# EAGLE design algyan-7th (EAGLE 9.6.2)
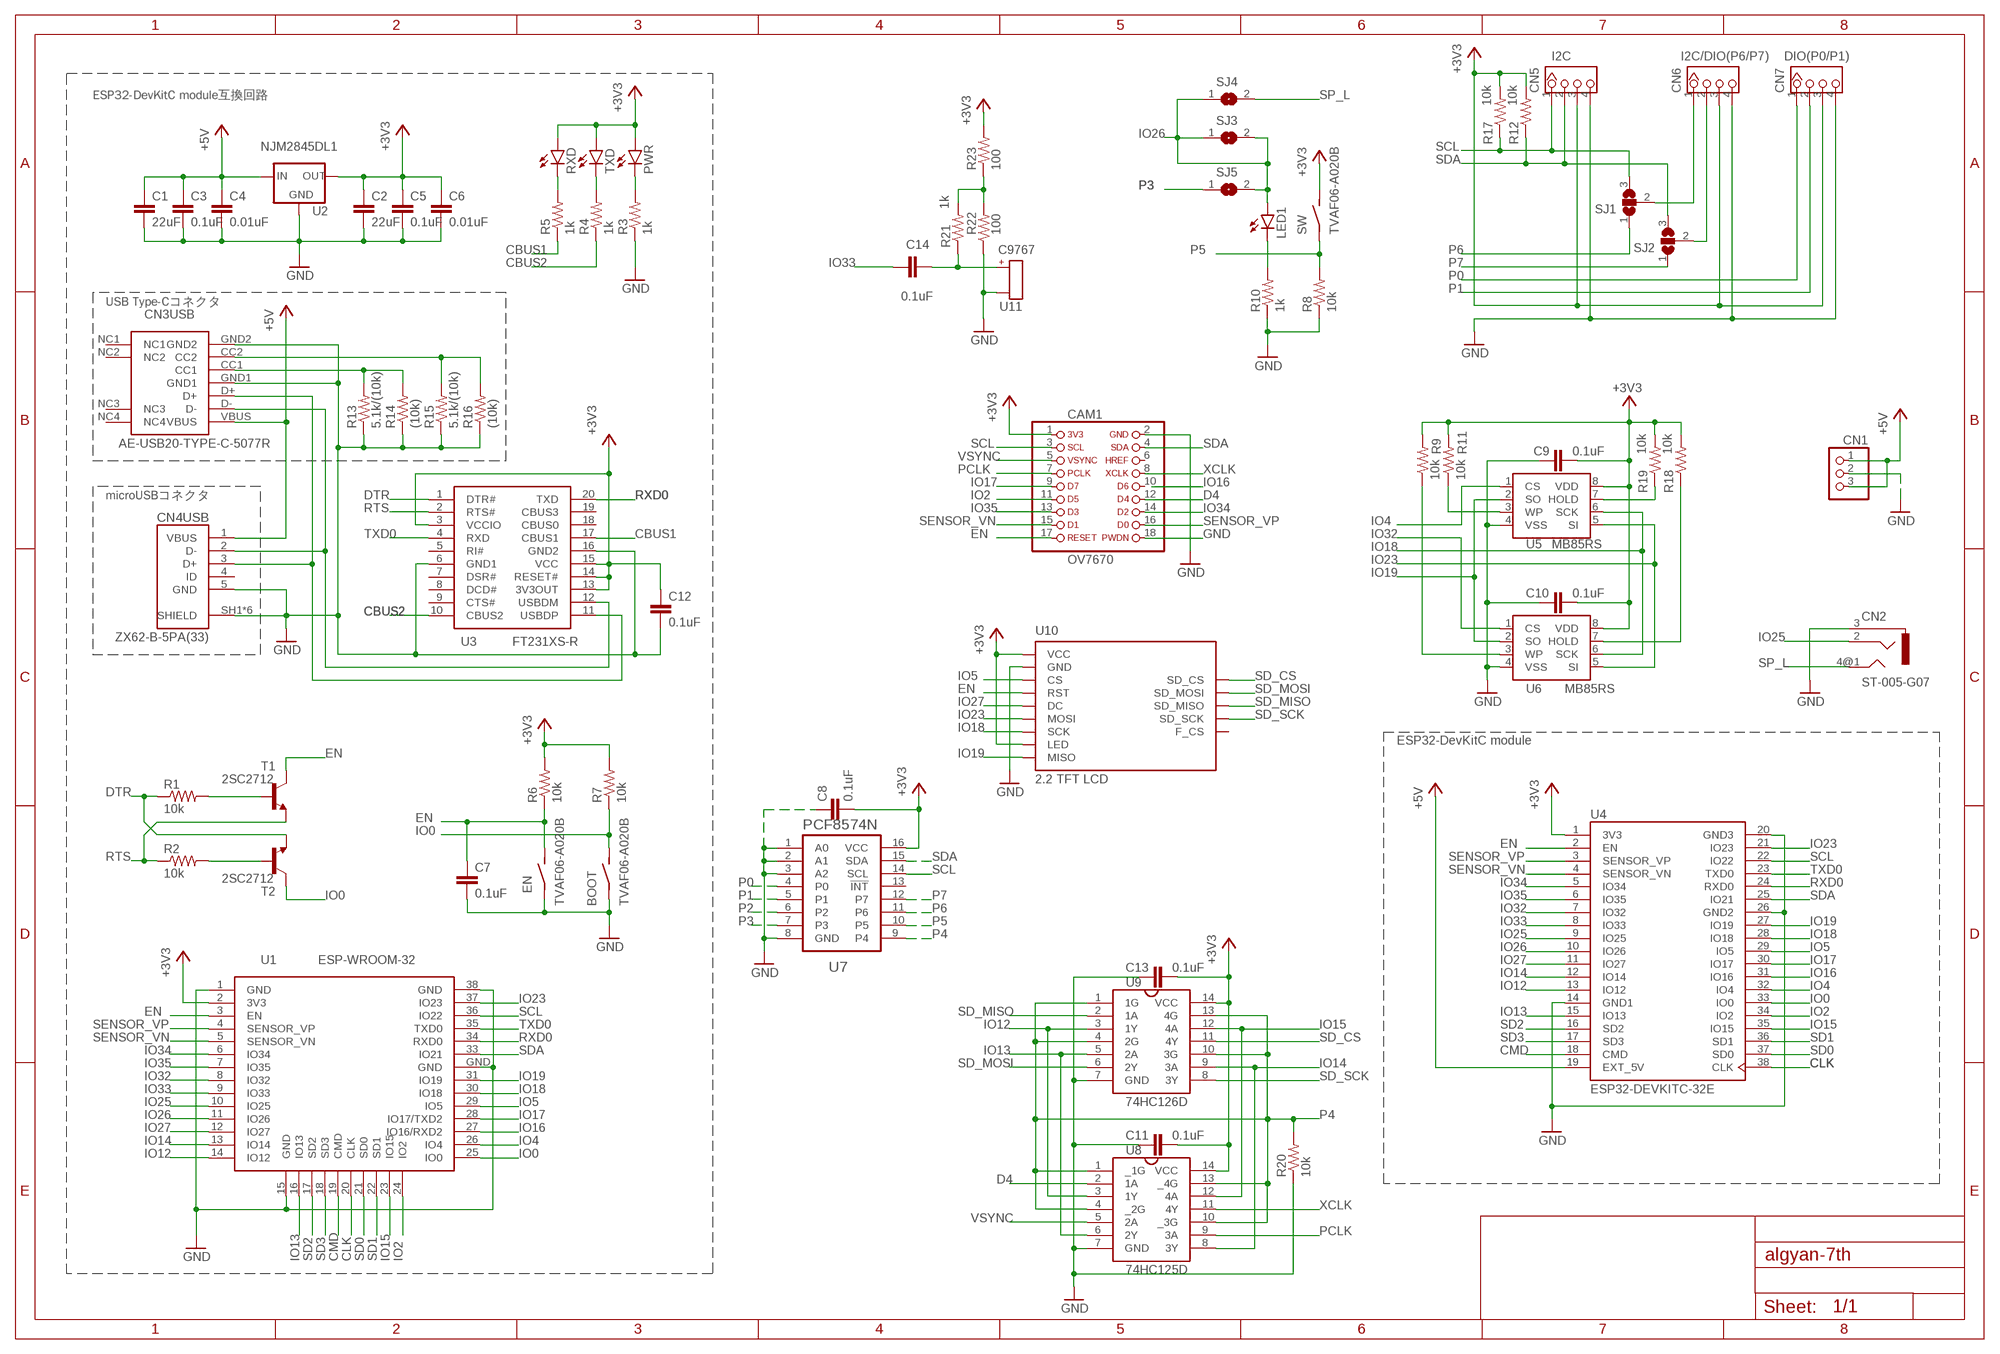
[diagram p0: schematic, sheet 1]

## Parts
BOOT  TVAF06-A020B  [TVAF06-A020B]
C1  22uF  C-EUC3216  [C3216]
C2  22uF  C-EUC3216  [C3216]
C3  0.1uF  C-EUC2012  [C2012]
C4  0.01uF  C-EUC1608  [C1608]
C5  0.1uF  C-EUC2012  [C2012]
C6  0.01uF  C-EUC1608  [C1608]
C7  0.1uF  C-EUC2012  [C2012]
C8  0.1uF  C-EUC2012  [C2012]
C9  0.1uF  C-EUC2012  [C2012]
C10  0.1uF  C-EUC2012  [C2012]
C11  0.1uF  C-EUC2012  [C2012]
C12  0.1uF  C-EUC2012  [C2012]
C13  0.1uF  C-EUC2012  [C2012]
C14  0.1uF  C-EUC2012  [C2012]
CAM1  OV7670  [OV7670]
CN1  PINHD-1X3/90  [1X03/90]
CN2  ST-005-G07  [ST-005-G]
CN3USB  AE-USB20-TYPE-C-5077R  [AE-USB20-TYPE-C-5077R]
CN4USB  ZX62-B-5PA(33)  [HRS_ZX62-B-5PA(33)]
CN5  4P-2.0-90D  GROVE-CONNECTOR-DIP-90D(4P-2.0)  [HW4-2.0-90D]
CN6  4P-2.0-90D  GROVE-CONNECTOR-DIP-90D(4P-2.0)  [HW4-2.0-90D]
CN7  4P-2.0-90D  GROVE-CONNECTOR-DIP-90D(4P-2.0)  [HW4-2.0-90D]
EN  TVAF06-A020B  [TVAF06-A020B]
LED1  LEDCHIPLED_0805  [CHIPLED_0805]
PWR  LEDCHIPLED_0805  [CHIPLED_0805]
R1  10k  R-US_R2012  [R2012]
R2  10k  R-US_R2012  [R2012]
R3  1k  R-US_R2012  [R2012]
R4  1k  R-US_R2012  [R2012]
R5  1k  R-US_R2012  [R2012]
R6  10k  R-US_R2012  [R2012]
R7  10k  R-US_R2012  [R2012]
R8  10k  R-US_R2012  [R2012]
R9  10k  R-US_R2012  [R2012]
R10  1k  R-US_R2012  [R2012]
R11  10k  R-US_R2012  [R2012]
R12  10k  R-US_R2012  [R2012]
R13  5.1k/(10k)  R-US_R2012  [R2012]
R14  (10k)  R-US_R2012  [R2012]
R15  5.1k/(10k)  R-US_R2012  [R2012]
R16  (10k)  R-US_R2012  [R2012]
R17  10k  R-US_R2012  [R2012]
R18  10k  R-US_R2012  [R2012]
R19  10k  R-US_R2012  [R2012]
R20  10k  R-US_R2012  [R2012]
R21  1k  R-US_R2012  [R2012]
R22  100  R-US_R2012  [R2012]
R23  100  R-US_R2012  [R2012]
RXD  LEDCHIPLED_0805  [CHIPLED_0805]
SJ1  SJ2W  [SJ_2]
SJ2  SJ2W  [SJ_2]
SJ3  SJ  [SJ]
SJ4  SJ  [SJ]
SJ5  SJ  [SJ]
SW  TVAF06-A020B  [TVAF06-A020B]
T1  2SC2712  2SC2712YBC808SOT23-BEC  [SOT23-BEC]
T2  2SC2712  2SC2712YBC808SOT23-BEC  [SOT23-BEC]
TXD  LEDCHIPLED_0805  [CHIPLED_0805]
U1  ESP-WROOM-32  [ESP-WROOM-32]
U2  NJM2845DL1  [D-PAK_TO252AA]
U3  FT231XS-R  [SOP64P599X175-20N]
U4  ESP32-DEVKITC-32E  ESP32-DEVKITC-32D  [MODULE_ESP32-DEVKITC-32D]
U5  MB85RS  [DIP8_SOP8]
U6  MB85RS  [DIP8_SOP8]
U7  PCF8574N  [DIP794W45P254L1969H508Q16]
U8  74HC125D  [SO14]
U9  74HC126D  [SO14]
U10  2.2_TFT_LCD  [2.2_TFT_LCD]
U11  C9767  [C9767]

## Nets
+3V3 [VDD]: C2.1 C5.1 C6.1 C8.2 C9.2 C10.2 C11.2 C12.1 C13.2 CAM1.1 CN5.3 CN6.3 CN7.3 PWR.A R6.2 R7.2 R9.2 R11.2 R12.2 R17.2 R18.2 R19.2 R23.2 RXD.A SW.2(S) TXD.A U1.2(3V3) U2.3(OUT) U3.3(VCCIO) U3.13(3V3OUT) U3.14(RESET#) U3.15(VCC) U4.1(3V3) U5.8(VDD) U6.8(VDD) U7.16(VCC) U8.14(VCC) U9.14(VCC) U10.LED U10.VCC
+5V [VDD]: C1.1 C3.1 C4.1 CN1.1 CN1.3 CN3USB.VBUS CN4USB.1(VBUS) U2.1(IN) U4.19(EXT_5V)
CBUS1: R5.1 U3.17(CBUS1)
CBUS2: R4.1 U3.10(CBUS2)
CLK: U1.20(CLK) U4.38(CLK)
CMD: U1.19(CMD) U4.18(CMD)
D4: CAM1.12 U8.2(1A)
DTR: R1.1 T2.E U3.1(DTR#)
EN: C7.1 CAM1.17 EN.2(S) R6.1 T1.C U1.3(EN) U4.2(EN) U10.RST
GND [GND]: BOOT.1(P) C1.2 C2.2 C3.2 C4.2 C5.2 C6.2 C7.2 C8.1 C9.1 C10.1 C11.1 C12.2 C13.1 CAM1.2 CAM1.18 CN1.2 CN2.3 CN3USB.GND1 CN3USB.GND2 CN4USB.5(GND) CN4USB.SH1(SHIELD) CN4USB.SH2(SHIELD) CN4USB.SH3(SHIELD) CN4USB.SH4(SHIELD) CN4USB.SH5(SHIELD) CN4USB.SH6(SHIELD) CN5.4 CN6.4 CN7.4 EN.1(P) R3.1 R8.1 R10.1 R13.1 R14.1 R15.1 R16.1 R20.1 R22.1 U1.1(GND) U1.15(GND) U1.38(GND) U1.GND U2.4(GND) U3.6(GND1) U3.16(GND2) U4.14(GND1) U4.20(GND3) U4.26(GND2) U5.4(VSS) U6.4(VSS) U7.1(A0) U7.2(A1) U7.3(A2) U7.8(GND) U8.7(GND) U9.7(GND) U10.GND U11.-
IO0: BOOT.2(S) R7.1 T2.C U1.25(IO0) U4.33(IO0)
IO2: CAM1.11 U1.24(IO2) U4.34(IO2)
IO4: U1.26(IO4) U4.32(IO4) U5.1(CS)
IO5: U1.29(IO5) U4.29(IO5) U10.CS
IO12: U1.14(IO12) U4.13(IO12) U8.3(1Y) U9.3(1Y)
IO13: U1.16(IO13) U4.15(IO13) U8.6(2Y) U9.5(2A)
IO14: U1.13(IO14) U4.12(IO14) U8.8(3Y) U9.9(3A)
IO15: U1.23(IO15) U4.35(IO15) U8.12(4A) U9.12(4A)
IO16: U1.27(IO16/RXD2) U4.31(IO16)
IO17: CAM1.9 U1.28(IO17/TXD2) U4.30(IO17)
IO18: U1.30(IO18) U4.28(IO18) U5.6(SCK) U6.6(SCK) U10.SCK
IO19: U1.31(IO19) U4.27(IO19) U5.2(SO) U6.2(SO) U10.MISO
IO23: U1.37(IO23) U4.21(IO23) U5.5(SI) U6.5(SI) U10.MOSI
IO25: CN2.2 U1.10(IO25) U4.9(IO25)
IO26: LED1.A SJ3.1 SJ3.2 SJ4.1 SJ5.2 U1.11(IO26) U4.10(IO26)
IO27: U1.12(IO27) U4.11(IO27) U10.DC
IO32: U1.8(IO32) U4.7(IO32) U6.1(CS)
IO33: C14.1 U1.9(IO33) U4.8(IO33)
IO34: CAM1.14 U1.6(IO34) U4.5(IO34)
IO35: CAM1.13 U1.7(IO35) U4.6(IO35)
N$1: R1.2 T1.B
N$2: R2.2 T2.B
N$3: LED1.C R10.2
N$4: C14.2 R21.1 U11.+
N$5: R9.1 U6.3(WP)
N$6: R11.1 U5.3(WP)
N$7: R21.2 R22.2 R23.1
N$8: R19.1 U5.7(HOLD)
N$9: R18.1 U6.7(HOLD)
N$10: CN6.2 SJ2.2
N$11: CN6.1 SJ1.2
N$13: CN3USB.CC1 R13.2 R14.2
N$14: CN3USB.CC2 R15.2 R16.2
N$74: CN3USB.D- CN4USB.2(D-) U3.12(USBDM)
N$81: CN3USB.D+ CN4USB.3(D+) U3.11(USBDP)
N$82: PWR.C R3.2
N$84: R5.2 RXD.C
P0: CN7.1 U7.4(P0)
P1: CN7.2 U7.5(P1)
P2: U7.6(P2)
P3: SJ5.1 U7.7(P3)
P4: R20.2 U7.9(P4) U8.1(_1G) U8.4(_2G) U8.10(_3G) U8.13(_4G) U9.1(1G) U9.4(2G) U9.10(3G) U9.13(4G)
P5: R8.2 SW.1(P) U7.10(P5)
P6: SJ1.1 U7.11(P6)
P7: SJ2.1 U7.12(P7)
PCLK: CAM1.7 U8.9(3A)
RTS: R2.1 T1.E U3.2(RTS#)
RXD0: U1.34(RXD0) U3.20(TXD) U4.24(RXD0)
SCL: CAM1.3 CN5.1 R17.1 SJ1.3 U1.36(IO22) U4.22(IO22) U7.14(SCL)
SD0: U1.21(SD0) U4.37(SD0)
SD1: U1.22(SD1) U4.36(SD1)
SD2: U1.17(SD2) U4.16(SD2)
SD3: U1.18(SD3) U4.17(SD3)
SD_CS: U9.11(4Y) U10.SD_CS
SD_MISO: U9.2(1A) U10.SD_MISO
SD_MOSI: U9.6(2Y) U10.SD_MOSI
SD_SCK: U9.8(3Y) U10.SD_SCK
SDA: CAM1.4 CN5.2 R12.1 SJ2.3 U1.33(IO21) U4.25(IO21) U7.15(SDA)
SENSOR_VN: CAM1.15 U1.5(SENSOR_VN) U4.4(SENSOR_VN)
SENSOR_VP: CAM1.16 U1.4(SENSOR_VP) U4.3(SENSOR_VP)
SP_L: CN2.4@1 SJ4.2
TTXD: R4.2 TXD.C
TXD0: U1.35(TXD0) U3.4(RXD) U4.23(TXD0)
VSYNC: CAM1.5 U8.5(2A)
XCLK: CAM1.8 U8.11(4Y)
Unconnected: CAM1.6 CAM1.10 CN2.4@2 CN3USB.NC1 CN3USB.NC2 CN3USB.NC3 CN3USB.NC4 CN4USB.4(ID) U3.5(RI#) U3.7(DSR#) U3.8(DCD#) U3.9(CTS#) U3.18(CBUS0) U3.19(CBUS3) U7.13(!INT) U10.F_CS

## Notes on the sheet
- ESP32-DevKitC module互換回路
- USB Type-Cコネクタ
- microUSBコネクタ
- ESP32-DevKitC module

## Library data of the parts
BOOT EN SW = swest-parts:TVAF06-A020B
C1-C14 = rcl:C-EU: CAPACITOR, European symbol; SPICEPREFIX: C
CAM1 = swest-parts:OV7670: PIN HEADER
CN1 = pinhead2:PINHD-1X3: PIN HEADER
CN2 = swest-parts:ST-005-G: Jack connectors according to JISC 6560, 3.5 mm Klinkensteckverbinder nach JISC 6560, 3,5 mm Source: http://www.lumberg.com/Produkte/PDFs/1503_08.pdf; OC_FARNELL: unknown; OC_NEWARK: unknown
CN3USB = swest-parts:AE-USB20-TYPE-C-5077R
CN4USB = swest-parts:ZX62-B-5PA(33): ZX Series 5 Position Right Angle PCB Wire Micro B USB Plug Buy Part <https://snapeda.com/parts/ZX62-B-5PA%2833%29/Hirose/view-part/?ref=eda>; ARROW_ELECTRONICS-PURCHASE-URL: https://snapeda.com/shop?store=Arrow+Electronics&id=524781; AVAILABILITY: Good; DESCRIPTION: USB - micro B USB 2.0 Receptacle Connector 5 Position Surface Mount, Right Angle; DIGIKEY-PURCHASE-URL: https://snapeda.com/shop?store=DigiKey&id=524781; MF: Hirose; MOUSER-PURCHASE-URL: https://snapeda.com/shop?store=Mouser&id=524781; MP: ZX62-B-5PA(33); PACKAGE: None; PRICE: None
CN5 = swest-parts:GROVE-CONNECTOR-DIP-90D(4P-2.0): 320110034; CN5: I2C
CN6 = swest-parts:GROVE-CONNECTOR-DIP-90D(4P-2.0): 320110034; CN6: I2C/DIO(P6/P7)
CN7 = swest-parts:GROVE-CONNECTOR-DIP-90D(4P-2.0): 320110034; CN7: DIO(P0/P1)
LED1 PWR RXD TXD = swest-parts:LED: LED OSRAM: - CHIPLED LG R971, LG N971, LY N971, LG Q971, LY Q971, LO R971, LY R971 LH N974, LH R974 LS Q976, LO Q976, LY Q976 LO Q996 - Hyper CHIPLED LW Q18S LB Q993, LB Q99A, LB R99A - SideLED LS A670, LO A670, LY A670, LG A670, LP A670 LB A673, LV A673, LT A673, LW A673 LH A674 LY A675 LS A676, LA A676, LO A676, LY A676, LW A676 LS A679, LY A679, LG A679 - Hyper Micro SIDELED® LS Y876, LA Y876, LO Y876, LY Y876 LT Y87S - SmartLED LW L88C, LW L88S LB L89C, LB L89S, LG L890 LS L89K, LO L89K, LY L89K LS L896, LA L896, LO L896, LY L896 - TOPLED LS T670, LO T670, LY T670, LG T670, LP T670 LSG T670, LSP T670, LSY T670, LOP T670, LYG T670 LG T671, LOG T671, LSG T671 LB T673, LV T673, LT T673, LW T673 LH T674 LS T676, LA T676, LO T676, LY T676, LB T676, LH T676, LSB T676, LW T676 LB T67C, LV T67C, LT T67C, LS T67K, LO T67K, LY T67K, LW E67C LS E67B, LA E67B, LO E67B, LY E67B, LB E67C, LV E67C, LT E67C LW T67C LS T679, LY T679, LG T679 LS T770, LO T770, LY T770, LG T770, LP T770 LB T773, LV T773, LT T773, LW T773 LH T774 LS E675, LA E675, LY E675, LS T675 LS T776, LA T776, LO T776, LY T776, LB T776 LHGB T686 LT T68C, LB T68C - Hyper Mini TOPLED® LB M676 - Mini TOPLED Santana® LG M470 LS M47K, LO M47K, LY M47K Source: http://www.osram.convergy.de LUXEON: - LUMILED® LXK2-PW12-R00, LXK2-PW12-S00, LXK2-PW14-U00, LXK2-PW14-V00 LXK2-PM12-R00, LXK2-PM12-S00, LXK2-PM14-U00 LXK2-PE12-Q00, LXK2-PE12-R00, LXK2-PE12-S00, LXK2-PE14-T00, LXK2-PE14-U00 LXK2-PB12-K00, LXK2-PB12-L00, LXK2-PB12-M00, LXK2-PB14-N00, LXK2-PB14-P00, LXK2-PB14-Q00 LXK2-PR12-L00, LXK2-PR12-M00, LXK2-PR14-Q00, LXK2-PR14-R00 LXK2-PD12-Q00, LXK2-PD12-R00, LXK2-PD12-S00 LXK2-PH12-R00, LXK2-PH12-S00 LXK2-PL12-P00, LXK2-PL12-Q00, LXK2-PL12-R00 Source: www.luxeon.com KINGBRIGHT: KA-3528ASYC Source: www.kingbright.com
R1-R23 = rcl:R-US_: RESISTOR, American symbol; SPICEPREFIX: R
SJ1 SJ2 = swest-parts:SJ2W: SMD solder JUMPER
SJ3-SJ5 = swest-parts:SJ: SMD solder JUMPER
T1 T2 = transistor:2SC2712Y: NPN Transistror BF959 corrected 2008.03.06
U1 = swest-parts:ESP-WROOM-32: Espressif Systems ESP-WROOM-32
U2 = swest-parts:NJM2845DL1
U3 = swest-parts:FT231XS-R: FTDI Chip FT231XS-R, Interface RS232, RS422, RS485, SIE, UART 3MBd, 5 V, 20-pin, SSOP Source: Datasheet <http://uk.rs-online.com/web/p/products/7570032P>; DESCRIPTION: FTDI Chip FT231XS-R, Interface RS232, RS422, RS485, SIE, UART 3MBd, 5 V, 20-pin, SSOP; HEIGHT: 1.7526mm; MANUFACTURER_NAME: FTDI Chip; MANUFACTURER_PART_NUMBER: FT231XS-R; RS_PART_NUMBER: 7570032P
U4 = swest-parts:ESP32-DEVKITC-32D: Eval Board For Esp-Wroom-32 Buy Part <https://snapeda.com/parts/ESP32-DEVKITC-32D/Espressif%20Systems/view-part/?ref=eda>; AVAILABILITY: Warning; DESCRIPTION: - Transceiver; 802.11 b/g/n (Wi-Fi, WiFi, WLAN), Bluetooth® Smart Ready 4.x Dual Mode For Use With ESP-WROOM-32; DIGIKEY-PURCHASE-URL: https://snapeda.com/shop?store=DigiKey&id=2777395; MF: Espressif Systems; MOUSER-PURCHASE-URL: https://snapeda.com/shop?store=Mouser&id=2777395; MP: ESP32-DEVKITC-32D; PACKAGE: None; PRICE: None
U5 U6 = swest-parts:MB85RS
U7 = swest-parts:PCF8574N: Check availability <https://pricing.snapeda.com/parts/PCF8574N/Texas%20Instruments/view-part?ref=eda>; AVAILABILITY: In Stock; DESCRIPTION: Remote 8-Bit I/O Expander for I2C-Bus 16-PDIP -40 to 85; MF: Texas Instruments; MP: PCF8574N; PACKAGE: PDIP-16 Texas Instruments; PRICE: None; PURCHASE-URL: https://pricing.snapeda.com/search/part/PCF8574N/?ref=eda
U8 = swest-parts:74*125: Quad bus BUFFER, 3-state
U9 = swest-parts:74*126: Quad bus BUFFER, 3-state
U10 = swest-parts:2.2_TFT_LCD
U11 = swest-parts:C9767: C9767 <http://akizukidenshi.com/catalog/g/gP-01810/> Electret Condenser Microphone; C9767: C9767

## Net classes
1 GND: width 0.305 mm
2 VDD: width 0.305 mm

## Board
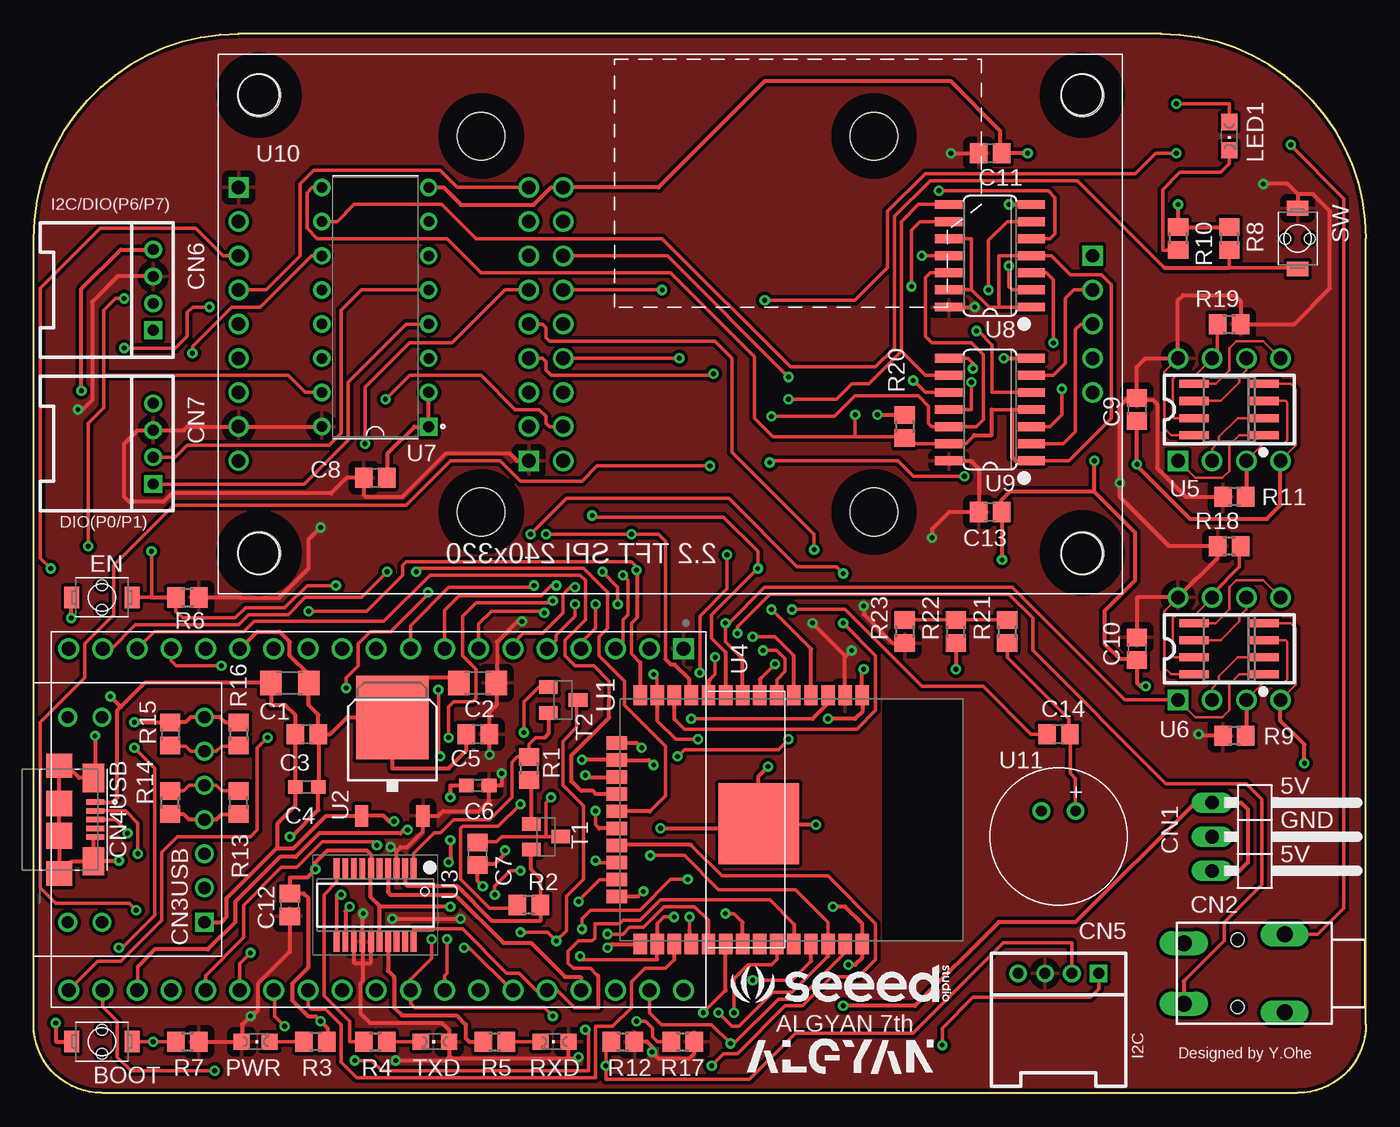
[diagram p1: board, top side]
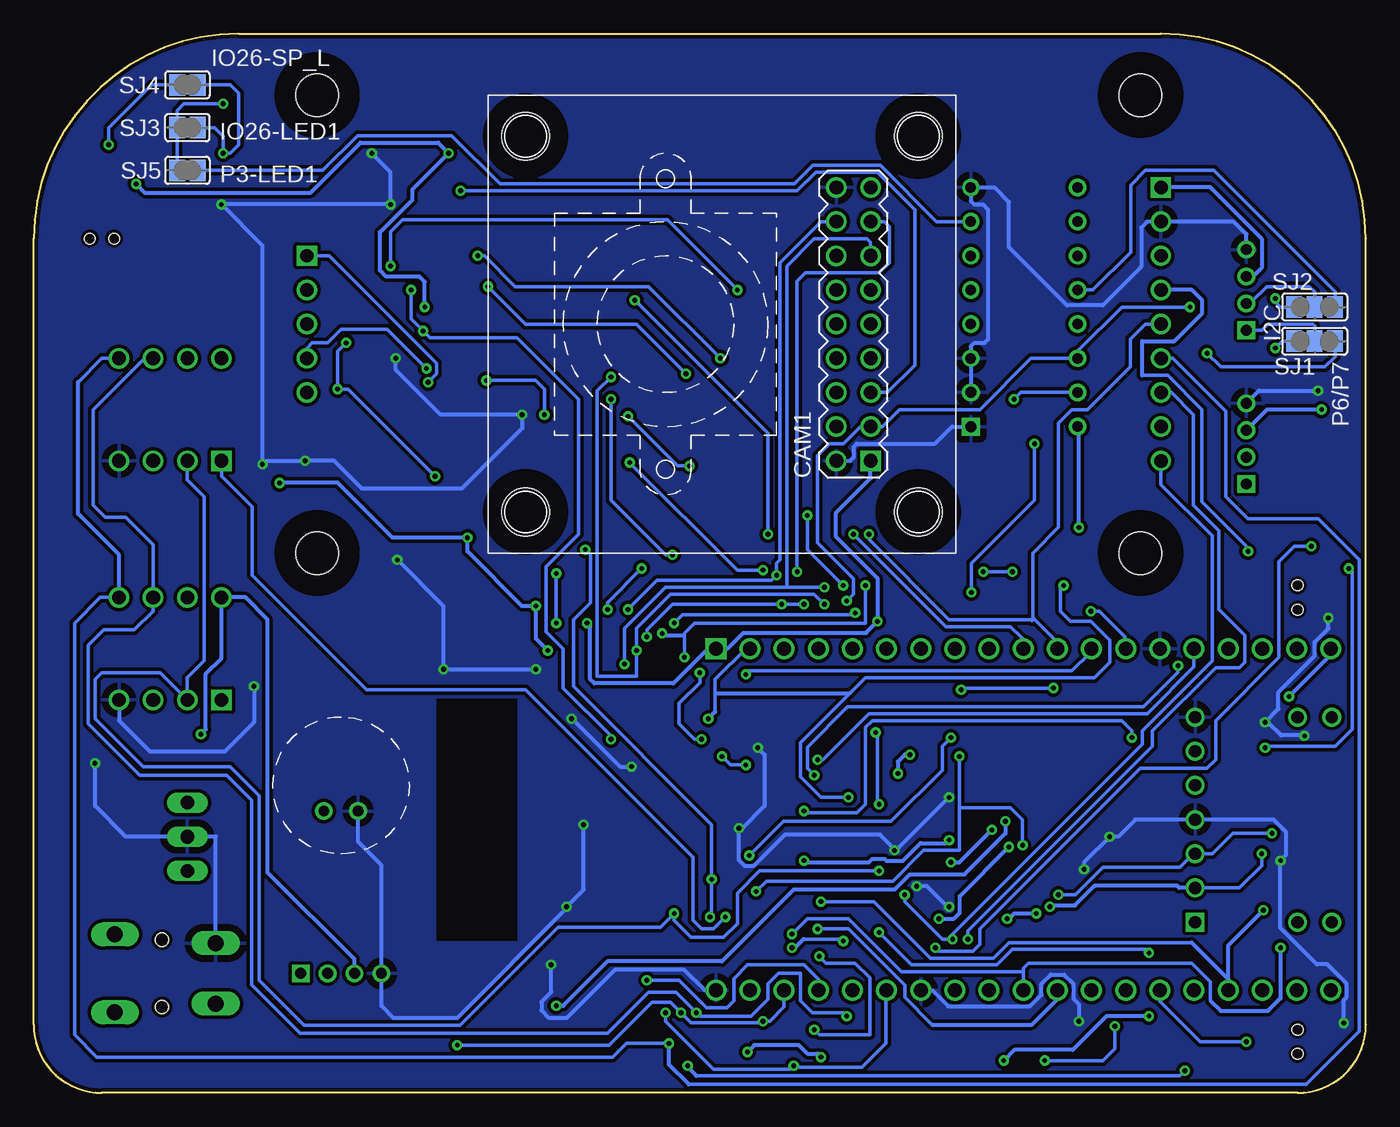
[diagram p2: board, bottom side, seen from below]

Size 99.06 x 78.74 mm. Coordinates in mm from the lower left corner, seen from the top.
Outline: 5.08,0 93.98,0 arc90 99.06,5.08 99.06,63.5 arc90 83.82,78.74 15.24,78.74 arc90 0,63.5 0,5.08 arc90 5.08,0
Copper layers (1*16): Top 0.035mm / dielectric 1.5mm / Bottom 0.035mm
Design rules "default *": minimum track width 10mil, minimum drill 0.35mm, track to track 10mil, track to pad 10mil, pad to pad 6mil, via to via 10mil, smd to smd 6mil, copper to edge 10mil, drill to drill 10mil, minimum pad ring 10mil, minimum via ring 8mil, stop-mask expansion 6mil, vias tented up to drill 0.4mm, thermal gap 20mil

### Footprints (pad centres in the part's own frame; a part is rotated, then mirrored left to right if it is on the bottom)
TVAF06-A020B = smd 1.1 x 1.6: 1 -2.25,0; 2 2.25,0 | hole 0.8: 0,0.9; 0,-0.9
C3216 = smd 1.6 x 1.8: 1 -1.4,0; 2 1.4,0
C2012 = smd 1.3 x 1.5: 1 -0.85,0; 2 0.85,0
C1608 = smd 1.1 x 1: 1 -0.85,0; 2 0.85,0
OV7670 = drill 1.016 square: 1 0,0 | drill 1.016: 2 2.54,0; 3 0,-2.54; 4 2.54,-2.54; 5 0,-5.08; 6 2.54,-5.08; 7 0,-7.62; 8 2.54,-7.62; 9 0,-10.16; 10 2.54,-10.16; 11 0,-12.7; 12 2.54,-12.7; 13 0,-15.24; 14 2.54,-15.24; 15 0,-17.78; 16 2.54,-17.78; 17 0,-20.32; 18 2.54,-20.32 | hole 3.556: -3.556,3.81; 25.654,3.81; 25.654,-24.13; -3.556,-24.13
1X03/90 = drill 1.016 long: 1 -2.54,-3.81; 2 0,-3.81; 3 2.54,-3.81
ST-005-G = drill 1.2 long: 2 2.25,-11; 3 -2.25,-11; 4@1 -2.9,-3.5; 4@2 2.9,-3.5 | hole 1: -2.5,-7; 2.5,-7
AE-USB20-TYPE-C-5077R = drill 0.9: CC1 0,10.16; CC2 0,12.7; D+ 0,5.08; D- 0,2.54; GND1 0,7.62; GND2 0,15.24; NC1 -10.16,15.24; NC2 -7.62,15.24; NC3 -10.16,0; NC4 -7.62,0 | drill 0.9 square: VBUS 0,0
HRS_ZX62-B-5PA(33) = smd 0.4 x 1.35: 1 -1.3,2.675; 2 -0.65,2.675; 3 0,2.675; 4 0.65,2.675; 5 1.3,2.675 | smd 2.1 x 1.6: SH1 -3.1,2.55; SH6 3.1,2.55 | smd 1.8 x 1.9: SH2 -4,0; SH5 4,0 | smd 1.9 x 1.9: SH3 -1.2,0; SH4 1.2,0
HW4-2.0-90D = drill 0.8 pad 1.27 square: 1 -3,0 | drill 0.8 pad 1.27: 2 -1,0; 3 1,0; 4 3,0
CHIPLED_0805 = smd 1.2 x 1.2: A 0,-1.05; C 0,1.05
R2012 = smd 1.3 x 1.5: 1 -0.85,0; 2 0.85,0
SJ_2 = smd 1.168 x 1.6: 1 -1.524,0; 2 0,0; 3 1.524,0
SJ = smd 1.168 x 1.6: 1 -0.762,0; 2 0.762,0
SOT23-BEC = smd 1 x 1.4: B -0.95,-1.1; C 0,1.1; E 0.95,-1.1
ESP-WROOM-32 = smd 1.5 x 1: 1 -9.25,7; 2 -9.25,5.73; 3 -9.25,4.46; 4 -9.25,3.19; 5 -9.25,1.92; 6 -9.25,0.65; 7 -9.25,-0.62; 8 -9.25,-1.89; 9 -9.25,-3.16; 10 -9.25,-4.43; 11 -9.25,-5.7; 12 -9.25,-6.97; 13 -9.25,-8.24; 14 -9.25,-9.51; 25 9.25,-9.51; 26 9.25,-8.24; 27 9.25,-6.97; 28 9.25,-5.7; 29 9.25,-4.43; 30 9.25,-3.16; 31 9.25,-1.89; 32 9.25,-0.62; 33 9.25,0.65; 34 9.25,1.92; 35 9.25,3.19; 36 9.25,4.46; 37 9.25,5.73; 38 9.25,7 | smd 1 x 1.5: 15 -5.7,-11.25; 16 -4.43,-11.25; 17 -3.16,-11.25; 18 -1.89,-11.25; 19 -0.62,-11.25; 20 0.65,-11.25; 21 1.92,-11.25; 22 3.19,-11.25; 23 4.46,-11.25; 24 5.73,-11.25 | smd 6 x 6: GND 0.3,-0.7
D-PAK_TO252AA = smd 1 x 1.6: 1 -2.28,-4.8; 3 2.28,-4.8 | smd 5.4 x 6.2: 4 0,2.5
SOP64P599X175-20N = smd 1.526 x 0.435: 1 -2.712,2.858; 2 -2.712,2.222; 3 -2.712,1.588; 4 -2.712,0.952; 5 -2.712,0.318; 6 -2.712,-0.318; 7 -2.712,-0.952; 8 -2.712,-1.588; 9 -2.712,-2.222; 10 -2.712,-2.858; 11 2.712,-2.858; 12 2.712,-2.222; 13 2.712,-1.588; 14 2.712,-0.952; 15 2.712,-0.318; 16 2.712,0.318; 17 2.712,0.952; 18 2.712,1.588; 19 2.712,2.222; 20 2.712,2.858
MODULE_ESP32-DEVKITC-32D = drill 1.04 square: 1 -12.7,19.76 | drill 1.04: 2 -12.7,17.22; 3 -12.7,14.68; 4 -12.7,12.14; 5 -12.7,9.6; 6 -12.7,7.06; 7 -12.7,4.52; 8 -12.7,1.98; 9 -12.7,-0.56; 10 -12.7,-3.1; 11 -12.7,-5.64; 12 -12.7,-8.18; 13 -12.7,-10.72; 14 -12.7,-13.26; 15 -12.7,-15.8; 16 -12.7,-18.34; 17 -12.7,-20.88; 18 -12.7,-23.42; 19 -12.7,-25.96; 20 12.7,19.76; 21 12.7,17.22; 22 12.7,14.68; 23 12.7,12.14; 24 12.7,9.6; 25 12.7,7.06; 26 12.7,4.52; 27 12.7,1.98; 28 12.7,-0.56; 29 12.7,-3.1; 30 12.7,-5.64; 31 12.7,-8.18; 32 12.7,-10.72; 33 12.7,-13.26; 34 12.7,-15.8; 35 12.7,-18.34; 36 12.7,-20.88; 37 12.7,-23.42; 38 12.7,-25.96
DIP8_SOP8 = drill 1.016 square: 1 -3.81,3.81 | drill 1.016: 2 -3.81,1.27; 3 -3.81,-1.27; 4 -3.81,-3.81; 5 3.81,-3.81; 6 3.81,-1.27; 7 3.81,1.27; 8 3.81,3.81 | smd 0.6 x 2.2: P1 -1.905,-2.6; P2 -0.635,-2.6; P3 0.635,-2.6; P4 1.905,-2.6; P5 1.905,2.6; P6 0.635,2.6; P7 -0.635,2.6; P8 -1.905,2.6
DIP794W45P254L1969H508Q16 = drill 0.813 square: 1 -3.97,8.89 | drill 0.813: 2 -3.97,6.35 | drill 0.78: 3 -3.97,3.81; 4 -3.97,1.27; 5 -3.97,-1.27; 6 -3.97,-3.81; 7 -3.97,-6.35; 8 -3.97,-8.89; 9 3.97,-8.89; 10 3.97,-6.35; 11 3.97,-3.81; 12 3.97,-1.27; 13 3.97,1.27; 14 3.97,3.81; 15 3.97,6.35; 16 3.97,8.89
SO14 = smd 0.66 x 2.032: 1 -3.81,-3.073; 2 -2.54,-3.073; 3 -1.27,-3.073; 4 0,-3.073; 5 1.27,-3.073; 6 2.54,-3.073; 7 3.81,-3.073; 8 3.81,3.073; 9 2.54,3.073; 10 1.27,3.073; 11 0,3.073; 12 -1.27,3.073; 13 -2.54,3.073; 14 -3.81,3.073
2.2_TFT_LCD = drill 1: CS 0,-5.08; DC 0,-10.16; F_CS 63.5,-15.24; GND 0,-2.54; LED 0,-17.78; MISO 0,-20.32; MOSI 0,-12.7; RST 0,-7.62; SCK 0,-15.24; SD_MISO 63.5,-10.16; SD_MOSI 63.5,-7.62; SD_SCK 63.5,-12.7 | drill 1 square: SD_CS 63.5,-5.08; VCC 0,0 | hole 3.175: 1.524,6.858; 1.524,-27.178; 62.738,-27.178; 62.738,6.858
C9767 = drill 0.8: + 1.27,1.905; - -1.27,1.905

### Placement (x,y rotation side)
BOOT  5.08,3.81 0 top
C1  19.05,30.48 0 top
C2  33.02,30.48 180 top
C3  20.32,26.67 0 top
C4  20.32,22.73 0 top
C5  33.02,26.67 180 top
C6  33.02,22.86 180 top
C7  33.02,17.78 270 top
C8  25.4,45.72 180 top
C9  82.04,50.8 90 top
C10  82.04,33.02 90 top
C11  71.12,69.85 180 top
C12  19.05,13.97 90 top
C13  71.12,43.18 180 top
C14  76.2,26.67 0 top
CAM1  36.83,46.99 180 bottom
CN1  91.44,19.05 270 top
CN2  96.52,8.89 270 top
CN3USB  12.7,12.7 0 top
CN4USB  1.91,20.32 270 top
CN5  76.2,8.89 180 top
CN6  8.89,59.69 90 top
CN7  8.89,48.26 90 top
EN  5.08,36.83 0 top
LED1  88.9,71.12 180 top
PWR  16.51,3.81 270 top
R1  36.83,24.13 270 top
R2  36.83,13.97 180 top
R3  20.95,3.81 180 top
R4  25.4,3.81 0 top
R5  34.29,3.81 0 top
R6  11.43,36.83 0 top
R7  11.43,3.81 0 top
R8  88.9,63.5 270 top
R9  89.28,26.54 180 top
R10  85.09,63.5 270 top
R11  89.28,44.32 180 top
R12  43.81,3.81 0 top
R13  15.24,21.59 90 top
R14  10.16,21.59 90 top
R15  10.16,26.67 270 top
R16  15.24,26.67 270 top
R17  48.26,3.81 0 top
R18  88.9,40.64 180 top
R19  88.9,57.15 0 top
R20  64.77,49.53 270 top
R21  72.39,34.29 90 top
R22  68.58,34.29 90 top
R23  64.77,34.29 270 top
RXD  38.73,3.81 90 top
SJ1  3.81,55.88 180 bottom
SJ2  3.81,58.42 180 bottom
SJ3  87.63,71.75 0 bottom
SJ4  87.63,74.93 180 bottom
SJ5  87.63,68.58 180 bottom
SW  93.98,63.5 90 top
T1  38.1,19.05 270 top
T2  39.37,29.21 270 top
TXD  29.84,3.81 90 top
U1  54.61,20.32 270 top
U2  26.67,25.4 0 top
U3  25.4,13.97 270 top
U4  28.57,20.32 270 top
U5  88.9,50.8 90 top
U6  88.9,33.02 90 top
U7  25.4,58.42 180 top
U8  71.12,62.23 90 top
U9  71.12,50.8 90 top
U10  15.24,67.31 0 top
U11  76.2,19.05 0 top

### Tracks (layer width: path | path; a pad name or v marks a point on that pad's centre or on a via)
+3V3  (via drill 0.35)
  Top 0.305: U3.13 23.81,9.72 23.88,9.65 24.51,9.65 | 24.51,9.65 25.02,9.65 25.08,9.71 U3.15 | 24.51,9.65 24.45,9.71 | 24.45,9.71 U3.14 24.45,13.27 v24.51,13.34 | U3.3 26.99,17.97 | 26.99,17.97 27.28,18.27 27.76,18.27 28.95,19.46 U2.3 30.09,20.6 30.45,20.95 33.11,20.95 33.87,21.72 C6.1 34.8,22.86 v34.8,23.75 | R17.2 49.11,2.92 48.73,2.54 46.48,2.54 v45.97,3.05 45.97,3.43 45.59,3.81 R12.2 | C12.1 19.05,10.49 16.67,8.11 16.67,6.16 16.22,5.71 v16.13,5.71 15.49,5.08 15.49,3.84 PWR.A R7.2 | 24.45,9.71 24.45,8.27 24.29,8.11 24.29,5.94 25.02,5.21 30.35,5.21 30.89,4.67 TXD.A | 93.98,66.8 95.12,66.8 96.39,65.53 96.39,59.82 93.73,57.15 R19.2 89.75,58.84 89.28,59.31 85.47,59.31 85.09,58.93 U5.8 82.68,54.61 82.04,53.98 C9.2 | 93.98,66.8 SW.2 | v61.72,36.2 61.72,35.58 63.86,33.44 R23.2 | v66.8,41.27 66.8,41.91 68.07,43.18 C13.2 70.27,46.41 69.69,46.99 U9.14 | CAM1.1 35.94,46.99 35.41,47.52 30.64,47.52 27.43,44.31 24.69,44.31 24.55,44.45 C8.2 23.28,45.72 22.14,44.58 10.29,44.58 9.66,43.94 7.11,43.94 6.73,44.32 6.73,48.24 7.75,49.26 CN7.3 11.18,49.26 11.45,49.53 U10.LED U7.16 | CN6.3 6.24,60.69 4.34,58.79 4.34,51.49 3.65,50.8 v3.3,50.8 | R6.2 15.36,36.83 15.39,36.8 18.26,36.8 20.45,38.99 20.45,41.15 v21.34,42.04 | v36.32,35.05 35.99,35.05 34.45,33.51 34.45,30.51 C2.1 34.42,28.82 33.88,28.29 33.88,26.68 C5.1 33.87,25.18 v33.91,25.15 | v60.83,32.89 60.34,32.4 U1.2 60.34,32.5 v57.91,34.92 | v26.92,2.41 30.64,2.41 30.89,2.67 TXD.A | v26.67,12.95 v31.75,12.95 | v26.54,18.29 26.67,18.29 26.99,17.97 | TXD.A 30.89,2.79 31.15,2.54 39.78,2.54 | 39.78,2.54 RXD.A | v40.51,2.67 40.39,2.54 39.78,2.54
  Top 0.305: U8.14 v69.98,58.42 | v68.2,69.85 C11.2 | C10.2 82.04,36.83 U6.8 88.05,39.79 R18.2 84.45,40.64 80.77,44.32 v80.77,45.34 80.77,51.05 81.37,51.65 C9.2 | v91.44,67.56 93.22,67.56 93.98,66.8 | C9.2 82.18,51.51 83.21,51.51 83.54,51.19 83.54,46.44 85.66,44.32 R11.2 | R9.2 86.74,26.54 v86.61,26.67
  Bottom 0.305: v60.83,32.89 61.72,33.78 v61.72,36.2 62.74,36.2 66.8,40.26 v66.8,41.27 72.38,41.27 76.47,45.36 80.53,45.36 80.56,45.34 v80.77,45.34 | CN5.3 75.2,9.92 81.66,16.38 81.66,35.18 83.31,36.83 U6.8 85.09,32.33 86.26,31.16 86.26,27.03 v86.61,26.67 | CN6.3 8.38,60.69 7.74,61.33 7.74,63.49 11.56,67.31 U10.VCC | v3.3,50.8 7.35,50.8 CN7.3 | v21.34,42.04 21.34,49.44 U7.16 | v57.91,34.92 57.68,34.7 57.68,30.77 57.37,30.45 51.49,30.45 48.93,33.02 U4.1 47.47,33.02 46.29,34.21 37.17,34.21 v36.32,35.05 36.32,38.26 39.39,41.33 39.39,43.12 36.83,45.69 CAM1.1 | v33.91,25.15 34.29,25.15 34.8,24.64 v34.8,23.75 | v16.13,5.71 16.15,5.74 19.25,5.74 21.79,3.2 26.14,3.2 v26.92,2.41 | v24.51,13.34 26.16,13.34 26.54,12.95 v26.67,12.95 | v31.75,12.95 30.64,12.95 30.2,13.39 30.2,14.63 v26.54,18.29 | v40.51,2.67 40.77,2.92 41.53,2.92 42.16,3.56 45.47,3.56 v45.97,3.05 | v69.98,58.42 69.98,60.29 70.37,60.68 72.84,60.68 73.3,61.14 73.3,63.98 70.89,66.39 70.89,67.16 v68.2,69.85 68.98,70.64 74.75,70.64 78.45,66.93 90.81,66.93 v91.44,67.56
  pour Top: 0,5.08 0,63.5 arc-90 15.24,78.74 83.82,78.74 arc-90 99.06,63.5 99.06,5.08 arc-90 93.98,0 5.08,0 arc-90
+5V  (via drill 0.35)
  Top 0.305: 6.48,28.7 8.26,30.48 C1.1 17.65,28.83 18.71,28.83 19.47,28.07 C3.1 C4.1 19.47,21.38 18.16,20.07 18.16,18.16 | 6.48,28.7 6.22,28.45 6.22,21.97 5.84,21.59 5.81,21.62 CN4USB.1 | 6.48,28.7 v5.71,29.46 | 18.16,18.16 19.3,18.16 21.74,20.6 U2.1 26.01,20.6 26.42,20.19 v26.8,20.19 | 18.16,18.16 18.03,18.16 14.35,14.48 14.35,13.08 13.97,12.7 CN3USB.VBUS | v60.2,6.48 65.53,6.48 71.75,12.7 77.47,12.7 86.36,21.59 CN1.1 89.79,21.59 90.3,21.08 90.3,17.14 89.66,16.51 CN1.3
  Bottom 0.305: v5.71,29.46 2.67,32.51 2.67,33.02 U4.19 | v60.2,6.48 59.69,6.48 56.39,9.78 47.88,9.78 42.55,15.11 35.05,15.11 33.91,16.26 29.84,16.26 26.8,19.3 v26.8,20.19
CBUS1
  Top 0.305: U3.17 26.35,9.08 26.8,8.64 26.8,6.35 27.38,5.77 31.45,5.77 32.13,5.08 32.13,4.06 32.38,3.81 R5.1
CBUS2
  Top 0.254: U3.10 22.54,15.68 21.59,14.73 21.59,7.24 23.5,5.33 23.5,3.81 R4.1
CLK  (via drill 0.35)
  Top 0.254: 42.05,19.67 41.78,19.94 v41.78,20.95 | v17.4,26.42 16.64,25.65 16.64,19.56 16.13,19.05 10.67,19.05 9.53,17.91 9.53,12.83 6.48,9.78 4.77,9.78 U4.38
  Top 0.305: U1.20 42.05,19.67
  Bottom 0.254: v41.78,20.95 41.66,20.83 37.85,20.83 37.21,21.46 37.21,27.18 36.7,27.69 18.16,27.69 17.4,26.92 v17.4,26.42
CMD  (via drill 0.35)
  Top 0.254: 45.85,20.95 46.99,22.1 46.99,25.78 43.94,28.83 43.94,30.61 42.04,32.51 42.04,33.91 42.67,34.54 42.67,37.21 40.89,38.99 28.7,38.99 v28.45,38.73 | v26.29,38.73 24.38,36.83 20.19,36.83 18.92,35.56 16,35.56 15.24,34.8 7.57,34.8 5.79,33.02 U4.18
  Top 0.305: 45.85,20.95 45.83,20.94 U1.19
  Bottom 0.254: v28.45,38.73 v26.29,38.73
D4  (via drill 0.35)
  Top 0.254: U8.2 72.77,59.69 72.52,59.94 v72.52,61.47 | v46.74,59.69 CAM1.12
  Bottom 0.254: v72.52,61.47 72.52,64.01 71.63,64.9 51.94,64.9 v46.74,59.69
DTR
  Top 0.254: 37.97,26.42 37.34,26.42 36.83,25.91 R1.1 35.94,24.98 35.56,24.6 35.56,21.97 33.91,20.32 31.24,20.32 30.27,19.35 29.78,19.35 28.26,17.82 U3.1
  Top 0.305: 37.97,26.42 38.27,26.71 T2.E
EN  (via drill 0.35)
  Top 0.254: 38.1,19.05 T1.C | v48.9,27.81 57.91,27.81 | v38.48,21.97 38.1,21.59 38.1,19.05 | EN.2 8.76,36.83 v8.76,40.26 | U10.RST 17.27,59.69 19.81,62.23 19.81,67.56 20.83,68.58 30.23,68.58 31.5,67.31 CAM1.17 | v22.48,37.72 20.32,37.72 18.67,36.07 15.75,36.07 14.99,35.31 11.09,35.31 10.58,35.81 R6.1 | 38.1,19.05 34.8,19.05 34.42,18.67 33.02,18.67 C7.1
  Top 0.305: 8.76,36.83 R6.1 | 57.91,27.81 59.07,28.97 U1.3
  Bottom 0.254: 48.39,28.32 48.39,29.72 48.39,30.73 46.1,33.02 U4.2 | v38.48,21.97 40.51,21.97 42.04,23.5 42.04,26.04 38.35,29.72 37.21,30.86 20.19,30.86 19.05,32 19.05,33.66 20.45,35.05 21.97,35.05 22.73,35.81 22.73,37.47 v22.48,37.72 | 16.64,53.34 14.73,53.34 12.19,50.8 12.19,43.94 8.76,40.51 v8.76,40.26
  Bottom 0.305: 16.64,53.34 16.64,55.88 14.26,55.88 12.17,57.97 12.17,58.91 12.95,59.69 U10.RST | 48.39,28.32 v48.9,27.81 | 48.39,29.72 38.35,29.72
GND  (via drill 0.35)
  Top 0.305: C3.2 21.21,26.67 21.21,22.73 C4.2 21.17,21.04 19.18,19.05 v19.05,19.05 | C2.2 31.24,30.86 26.92,30.86 26.67,30.61 U2.4 | 78.87,44.7 72.61,44.7 71.97,44.07 C13.1 72.01,43.18 v72.01,39.62 | v30.99,21.97 30.99,22.86 C6.2 | R14.1 10.16,20.7 11.18,20.7 11.56,20.32 CN3USB.GND1 13.59,20.32 13.97,20.7 15.24,20.7 R13.1 | R3.1 21.84,3.85 21.84,4.83 v21.34,5.33 20.98,5.69 20.43,5.69 19.21,6.91 19.21,8.11 20.45,9.35 20.45,14.46 20.09,14.81 C12.2 19.05,16 20.32,16 v20.95,16.64 20.95,17.14 21.84,18.03 24.77,18.03 25.08,17.72 U3.6 25.07,14.55 25.72,13.91 25.72,13.84 | 10.16,27.56 11.3,27.56 11.68,27.94 CN3USB.GND2 13.84,27.94 14.22,27.56 15.24,27.56 R16.1 | 10.16,27.56 R15.1 | v45.21,25.65 44.85,26.02 U1.15 | v60.58,9.53 61.09,9.53 61.61,10.05 U1.38 61.61,12.57 60.33,13.84 v59.44,13.84 | v61.72,31.5 61.59,31.37 61.59,29.59 U1.1 61.61,28.34 61.09,27.81 v59.05,27.81 | C8.1 26.29,45.72 26.29,47.5 28.32,49.53 U7.1 U7.2 | v62.74,50.42 64.77,50.42 R20.1 | v85.09,66.04 R10.1 R8.1 | v1.65,5.21 1.65,3.81 BOOT.1 | v2.79,35.31 2.79,36.83 EN.1 | v72.14,54.61 U9.7 | v72.52,66.04 U8.7 | 78.87,44.7 81.92,41.66 81.92,38.1 79.63,35.81 79.63,33.4 80.77,32.26 82.04,32.26 C10.1 82.04,30.48 82.3,30.23 v82.68,30.23 | U4.14 15.37,33.02 16.64,34.29 18.29,34.29 19.05,33.53 19.05,32.51 20.45,31.11 C1.2 20.45,28.83 21.17,28.11 C3.2 | C5.2 32.17,25.44 30.86,24.13 26.67,24.13 U2.4 | v35.05,18.03 35.05,17.78 34.29,17.02 33.02,17.02 C7.2 33.02,15.75 v33.4,15.37 | v7.49,27.56 10.16,27.56 | v46.61,19.68 53.85,19.68 53.98,19.81 53.98,19.95 U1.GND | U7.8 30.49,67.31 31.78,66.02 37.19,66.02 38.48,67.31 CAM1.18 46.48,67.31 54.36,75.18 68.2,75.18 71.88,71.5 71.88,69.85 C11.1 v73.91,69.85
  Top 0.305: v3.56,52.2 3.56,59.77 6.48,62.69 CN6.4 | v30.99,13.84 25.72,13.84 | U3.16 25.72,13.84 | C9.1 v82.04,46.74 82.04,46.61 85.98,42.67 91.69,42.67 92.71,43.69 U5.4 | R22.1 v68.58,31.5 | 78.87,44.7 v78.87,46.99 | v58.17,19.94 53.99,19.94 U1.GND | v54.61,24.26 53.91,23.56 U1.GND | v6.35,17.27 6.3,17.22 CN4USB.SH6 | CN4USB.SH6 4.46,18.89 CN4USB.5 | CN4USB.SH6 2.81,17.22 CN4USB.SH5 CN4USB.SH4 CN4USB.SH3 CN4USB.SH2 2.48,24.32 3.38,23.42 CN4USB.SH1 4.57,23.54 v4.57,26.54 | C3.2 22.06,26.67 23.33,27.94 26.63,27.94 U2.4 | v94.49,24.51 94.49,25.91 92.71,27.69 U6.4
  Bottom 0.305: v30.99,21.97 34.92,18.03 v35.05,18.03 35.05,18.13 36.12,19.2 43.19,19.2 45.52,16.87 46.17,16.87 46.63,17.33 46.63,19.66 v46.61,19.68 46.35,19.68 44.7,21.34 44.7,25.15 v45.21,25.65 | v20.95,16.64 20.95,17.14 v19.05,19.05 18.41,19.05 17.14,20.32 CN3USB.GND1 6.86,20.32 5.97,19.43 5.97,17.65 v6.35,17.27 6.35,12.27 3.63,9.56 2.88,9.56 1.43,8.11 1.43,7.13 1.65,6.91 v1.65,5.21 | v58.17,19.94 58.17,15.11 v59.44,13.84 59.44,13.72 67.59,5.57 72.29,5.57 73.2,6.48 CN5.4 73.2,16.94 74.93,18.67 U11.- | U4.20 49.16,7.62 50.7,9.17 55.82,9.17 59.42,5.57 60.73,5.57 61.3,6.13 61.3,6.77 60.58,7.49 v60.58,9.53 | v61.72,31.5 v68.58,31.5 68.58,36.2 v72.01,39.62 | v72.14,54.61 72.14,53.75 68.8,50.42 v62.74,50.42 62.74,49.4 67.21,44.94 74.65,44.94 76.71,46.99 v78.87,46.99 81.79,46.99 v82.04,46.74 82.04,62.99 v85.09,66.04 v72.52,66.04 72.52,68.45 v73.91,69.85 | v59.05,27.81 59.02,27.81 55.47,24.26 v54.61,24.26 | U7.2 U7.3 29.37,55.5 29.12,55.75 28.35,55.75 28.1,56.01 28.1,65.66 28.48,66.04 29.12,66.04 29.37,66.29 U7.8 27.63,67.31 26.54,66.22 26.54,62.86 22.23,58.55 19.56,58.55 16.7,61.41 16.7,64.33 16.26,64.77 U10.GND 9.83,64.77 8.89,63.83 CN6.4 | CN7.4 7.95,52.2 v3.56,52.2 | U7.1 30.77,49.53 32.04,48.26 37.85,48.26 38.1,48.01 38.1,47.24 38.35,46.99 CAM1.2 | U4.26 32.23,7.62 31.05,6.43 24.98,6.43 24.12,7.3 24.12,8.11 23.43,8.81 22.44,8.81 21.75,8.11 21.75,6.99 21.34,6.58 v21.34,5.33 | v30.99,13.84 31.11,13.84 32.64,15.37 v33.4,15.37 | U6.4 92.71,27.69 90.42,25.4 84.84,25.4 82.68,27.56 v82.68,30.23 | v94.49,24.51 94.49,21.34 92.2,19.05 CN1.2 85.52,19.05 CN2.3
  Bottom 0.305: v4.57,26.54 4.61,26.58 6.3,26.58 7.29,27.56 v7.49,27.56 6.5,28.55 6.5,29.79 3.8,32.49 3.8,33.51 2.79,34.52 v2.79,35.31
  pour Bottom: 0,5.08 0,63.5 arc-90 15.24,78.74 83.82,78.74 arc-90 99.06,63.5 99.06,5.08 arc-90 93.98,0 5.08,0 arc-90
IO0  (via drill 0.35)
  Top 0.254: BOOT.2 v8.89,3.81 R7.1 | T2.C 40.39,29.21 40.39,27.18 39.37,26.16 39.37,22.86 40.89,21.34 40.89,15.88 39.62,14.61 39.62,12.06 v38.86,11.3 38.23,11.94 v36.2,11.94 | v16.13,10.41 15.31,9.6 U4.33
  Top 0.305: v42.67,10.79 42.9,11.03 43,11.03 43.04,11.07 U1.25
  Bottom 0.254: v8.89,3.81 12.32,3.81 15.31,6.81 U4.33 | 41.82,11.43 38.99,11.43 v38.86,11.3 | v16.13,10.41 16.38,10.67 26.29,10.67 27.43,9.53 33.78,9.53 v36.2,11.94
  Bottom 0.305: v42.67,10.79 42.45,10.79 41.82,11.43
IO2  (via drill 0.35)
  Top 0.254: v45.34,14.99 44.96,14.61 | v25.53,18.41 25.27,18.67 21.46,18.67 19.56,16.76 18.41,16.76 15.62,13.97 15.62,11.56 12.78,8.71 U4.34 | CAM1.11 35.05,59.69 31.11,55.75 27.94,55.75 24.64,52.45 v24.64,48.26 | v29.34,37.21 29.34,37.08 26.54,34.29 25.02,34.29 24.13,33.4 24.13,31.75 23.24,30.86 v23.24,30.1 | v30.23,25.02 30.1,25.15 v30.1,29.97
  Top 0.305: 44.96,14.61 44.94,14.59 U1.24
  Bottom 0.254: v45.34,14.99 44.58,15.75 35.18,15.75 32.89,18.03 30.23,18.03 30.23,21.21 | 30.23,21.21 26.42,21.21 25.53,20.32 v25.53,18.41 | v24.64,48.26 24.64,44.07 29.34,39.37 v29.34,37.21 | v23.24,30.1 29.97,30.1 v30.1,29.97 | 30.23,21.21 v30.23,25.02
IO4  (via drill 0.35)
  Top 0.254: 46.35,12.57 46.86,13.08 v47.62,13.08 | v18.67,4.95 17.91,5.71 17.91,7.62 U4.32 | v23.88,2.41 25.15,2.41 25.91,1.65 41.27,1.65 41.27,4.45 v41.02,4.7 | 46.35,9.91 40.89,9.91 v40.64,10.16
  Top 0.305: 46.35,9.91 46.37,9.92 U1.26 46.35,11.09 46.35,12.57
  Bottom 0.254: v47.62,13.08 48.51,12.19 49.4,12.19 50.04,12.83 50.04,17.53 62.48,29.97 74.3,29.97 82.8,38.48 82.8,43.56 85.09,45.85 U5.1 | v23.88,2.41 19.56,2.41 18.67,3.3 v18.67,4.95 | v41.02,4.7 40.64,4.32 36.89,4.32 36.89,8.57 37.97,9.65 40.13,9.65 v40.64,10.16
IO5  (via drill 0.35)
  Top 0.254: 50.16,12.83 49.15,13.84 46.86,13.84 45.34,12.32 44.32,12.32 43.81,11.81 v42.67,11.81 | U10.CS 14.1,62.23 12.06,64.26 4.95,64.26 0.51,59.82 0.51,39.75 v1.27,38.99 | v7.49,25.65 9.02,24.13 9.02,13.21 6.6,10.79 v6.35,10.79
  Top 0.305: U1.29 50.18,12.81 50.16,12.83
  Bottom 0.254: v42.67,11.81 41.53,12.95 38.48,12.95 34.54,9.02 25.48,9.02 | v1.27,38.99 1.02,38.73 1.02,27.05 2.29,25.78 7.37,25.78 v7.49,25.65 | 11.56,6.86 11.56,8.26 12.95,9.65 25.09,9.65 25.48,9.27 25.48,9.02 | U4.29 25.48,9.02
  Bottom 0.305: 11.56,6.86 10.79,6.1 7.29,6.1 6.35,7.03 v6.35,10.79
IO12  (via drill 0.35)
  Top 0.254: U9.3 75.56,49.53 76.45,50.42 v76.45,52.32 | v75.82,55.75 75.82,60.45 75.31,60.96 U8.3 | 45.1,31.99 44.45,32.64 44.45,34.92 44.9,35.37 | v44.83,38.86 44.83,39.12 44.45,39.5 27.69,39.5 27.43,39.24 27.43,38.48 24.77,35.81 v20.45,35.81 | v69.22,45.85 65.41,45.85 64.26,46.99 54.86,46.99 v54.74,46.86
  Top 0.305: 44.9,35.37 44.9,38.8 v44.83,38.86 | 45.1,31.99 U1.14
  Bottom 0.254: v75.82,55.75 76.45,55.12 v76.45,52.32 75.69,52.32 v69.22,45.85 | v20.45,35.81 19.81,35.81 17.91,33.91 17.91,33.02 U4.13 | v54.74,46.86 46.74,38.86 v44.83,38.86
IO13  (via drill 0.35)
  Top 0.254: U9.5 71.25,52.07 71.25,55.63 70.23,56.64 v70.1,56.64 | v70.99,59.69 70.99,63.37 72.39,64.77 U8.6 | v47.88,25.02 48.39,25.53 55.37,25.53 v56.13,26.29
  Top 0.305: v40.77,24.77 43.34,24.77 U1.16 45.73,24.75 v46.1,24.38
  Bottom 0.254: v70.99,59.69 70.99,57.53 v70.1,56.64 69.6,56.13 63.12,56.13 58.55,51.56 58.55,41.53 60.96,39.12 60.96,34.29 59.69,33.02 59.69,30.1 56.13,26.54 v56.13,26.29 | v40.77,24.77 40.39,24.77 36.96,28.19 16.26,28.19 12.78,31.68 U4.15 | v47.88,25.02 47.24,24.38 v46.1,24.38
IO14  (via drill 0.35)
  Top 0.254: U9.9 66.29,53.34 64.52,55.12 | 64.52,55.12 64.52,64.77 65.79,66.04 U8.8 | U1.13 46.37,30.85 v46.1,31.11 | v56.13,51.56 59.69,51.56 60.83,52.7 62.1,52.7 64.52,55.12 | v51.56,40.01 51.56,37.47 49.53,35.43 v49.53,31.24 | v49.4,26.29 47.75,26.29 46.37,27.67
  Top 0.305: U1.13 46.37,27.67
  Bottom 0.254: v46.1,31.11 45.85,31.37 21.84,31.37 20.45,32.77 20.45,33.02 U4.12 | v56.13,51.56 56.13,44.07 52.07,40.01 v51.56,40.01 | v49.53,31.24 49.53,30.48 51.05,28.96 51.05,27.43 49.91,26.29 v49.4,26.29
IO15  (via drill 0.35)
  Top 0.254: U8.12 66.67,60.96 66.29,60.58 66.29,56.26 66.8,55.75 69.72,55.75 70.61,54.86 70.61,50.04 70.1,49.53 U9.12 66.8,49.53 66.55,49.78 66.55,51.05 65.79,51.82 61.09,51.82 59.56,50.29 v54.86,50.29 | U1.23 42.09,15.86 40.51,14.28 v40.51,14.22 | v50.29,46.61 41.91,46.61 40.77,45.47 36.2,45.47 34.67,46.99 30.99,46.99 27.69,43.69 10.41,43.69 5.97,39.24 5.97,35.56 3.81,33.4 3.81,30.86 0.51,27.56 0.51,15.24 1.65,14.1 7.11,14.1 v7.62,13.59
  Bottom 0.254: v40.51,14.22 36.58,14.22 32.38,10.03 27.69,10.03 26.54,11.18 12.95,11.18 | v50.29,46.61 51.18,46.61 v54.86,50.29
  Bottom 0.305: U4.35 10.23,8.46 | 10.23,8.46 10.23,10.97 v7.62,13.59 | 10.23,8.46 12.95,11.18
IO16
  Top 0.254: 47.62,9.91 46.99,9.27 45.47,9.27 44.45,8.26 44.45,6.35 43.05,4.95 41.78,4.95 41.78,1.14 24,1.14 22.86,2.29 22.86,5.08 21.72,6.22 20.65,6.22 20.39,6.48 U4.31
  Top 0.305: 47.62,9.91 47.64,9.92 U1.27
IO17  (via drill 0.35)
  Top 0.254: v48.77,13.08 48.77,12.07 | v58.04,40.39 58.04,41.53 51.94,47.62 51.94,54.61 50.67,55.88 38.35,55.88 38.1,56.13 38.1,56.9 37.85,57.15 CAM1.9 | v40.77,12.19 40.77,12.95 41.4,13.59 45.09,13.59 47.37,15.88 v48.64,15.88
  Top 0.305: 48.77,12.07 48.77,11.21 U1.28
  Bottom 0.254: v48.77,13.08 48.64,13.21 v48.64,15.88 48.64,19.94 58.93,30.23 58.93,35.18 57.66,36.45 57.66,40.01 v58.04,40.39 | 32.26,5.08 34.29,7.11 34.29,8 38.48,12.19 v40.77,12.19
  Bottom 0.305: 32.26,5.08 24.84,5.08 22.93,6.99 U4.30
IO18  (via drill 0.35)
  Top 0.254: v49.78,5.97 51.44,7.62 | v38.61,5.71 37.97,6.35 28.32,6.35 28.02,6.66 U4.28 28.02,8.46 29.59,10.03 v29.59,11.43
  Top 0.305: 51.44,7.62 51.45,7.63 U1.30
  Bottom 0.254: v38.61,5.71 38.86,5.97 41.15,5.97 42.04,6.86 42.04,8.89 43.69,8.89 44.45,8.13 44.45,6.99 45.72,5.71 49.53,5.71 v49.78,5.97 51.31,7.49 53.34,7.49 56.39,4.45 79.25,4.45 82.83,8.03 82.83,21.74 84.71,23.62 91.19,23.62 95,27.43 95,33.27 93.85,34.42 91.57,34.42 90.17,35.81 U6.6 90.17,40.77 92.2,42.8 93.73,42.8 94.61,43.69 94.61,50.8 90.81,54.61 U5.6 | U10.SCK 14.48,52.07 12.83,50.42 12.83,43.69 10.92,41.78 10.92,35.94 9.02,34.04 9.02,32 9.4,31.62 11.18,31.62 15.88,26.92 15.88,25.78 29.59,12.06 v29.59,11.43
IO19  (via drill 0.35)
  Top 0.254: 52.7,12.7 52.07,13.34 v51.44,13.34 | v36.2,16.51 35.43,16.51 34.29,15.37 v34.29,14.73 | v30.73,11.43 30.73,8.89 30.55,8.71 U4.27
  Top 0.305: U1.31 52.72,12.69 52.7,12.7
  Bottom 0.254: v36.2,16.51 45.09,16.51 46.74,14.86 46.74,12.57 47.75,11.56 50.16,11.56 51.44,12.83 v51.44,13.34 52.45,12.32 60.08,12.32 67.37,5.03 78.95,5.03 82.3,8.38 82.3,22.1 84.43,24.23 90.9,24.23 94.49,27.82 94.49,30.73 93.98,31.24 89.66,31.24 U6.2 87.63,30.86 86.36,32.13 86.36,44.32 87.63,45.59 U5.2 | v34.29,14.73 34.29,14.22 31.5,11.43 v30.73,11.43 30.73,11.81 16.64,25.91 16.64,26.92 11.43,32.13 11.43,41.4 15.24,45.21 U10.MISO
IO23  (via drill 0.35)
  Top 0.254: U1.37 60.45,10.96 60.45,10.54 56.9,6.99 55.37,6.99 52.07,3.68 v51.82,3.68 50.42,5.08 46.68,5.08 45.8,5.97 U4.21
  Bottom 0.254: U10.MOSI 14.35,54.61 10.41,50.67 10.41,44.32 8.76,42.67 3.56,42.67 0.51,39.62 0.51,4.57 4.45,0.64 50.35,0.64 | U5.5 93.98,54.61 95.76,52.83 | v51.82,3.68 54.99,3.68 56.01,2.67 94.36,2.67 96.01,4.32 96.01,34.92 94.11,36.83 U6.5
  Bottom 0.305: 50.35,0.64 51.82,2.1 v51.82,3.68 | U6.5 92.71,40.01 95.76,43.05 95.76,52.83
IO25  (via drill 0.35)
  Top 0.254: v50.67,32.38 50.67,31.11 50.29,30.73 | v37.21,37.72 37.08,37.59 30.86,37.59 28.02,34.75 U4.9 | 85.6,8.38 88.52,11.3 88.52,12.7 91.31,15.49 91.31,21.84 90.17,22.99 84.2,22.99 74.3,32.89 74.3,35.31 72.52,37.08 54.74,37.08 52.32,34.67 v52.32,34.16
  Top 0.305: 50.29,30.73 50.18,30.62 U1.10 | 85.6,8.38 85.52,8.3 CN2.2
  Bottom 0.254: v50.67,32.38 50.67,34.04 50.67,34.16 49.91,34.92 37.21,34.92 v37.21,37.72
  Bottom 0.305: v52.32,34.16 52.2,34.04 50.67,34.04
IO26  (via drill 0.35)
  Top 0.254: 46.99,32.26 46.99,41.02 46.48,41.53 v44.45,41.53 v38.1,41.53 | v54.36,58.93 61.09,58.93 63.5,61.34 63.5,65.53 66.29,68.33 81.92,68.33 83.44,69.85 v84.96,69.85 | v84.96,73.53 88.9,73.53 LED1.A
  Top 0.305: U1.11 48.77,29.71 48.77,30.73 47.67,31.83 47.39,31.83 46.99,32.23 46.99,32.26
  Bottom 0.254: v38.1,41.53 31.24,34.67 26.42,34.67 25.53,33.78 25.53,33.02 U4.10 | v44.45,41.53 44.45,49.02 v54.36,58.93 | SJ3.1 SJ3.2 85.6,71.75 84.96,71.12 v84.96,69.85 84.45,69.85 83.82,70.48 83.82,74.3 84.45,74.93 SJ4.1 | SJ3.1 88.39,73.03 87.88,73.53 v84.96,73.53 | SJ5.2 SJ3.1
IO27  (via drill 0.35)
  Top 0.254: 47.75,27.69 48.39,27.05 61.21,27.05 62.61,28.45 62.61,32.51 v60.2,34.92 | v60.2,38.61 59.69,39.12 56.77,39.12 51.69,44.2 39.62,44.2 v36.96,41.53
  Top 0.305: 47.75,27.69 47.64,27.8 U1.12
  Bottom 0.254: v60.2,38.61 v60.2,34.92 | v36.96,41.53 36.96,41.15 30.99,35.18 24.89,35.18 24.83,35.12 24.77,35.18 24.77,35.31 | 24.77,35.31 22.99,33.53 22.99,33.02 U4.11 | U10.DC 16.38,57.15 17.53,56.01 17.53,53.98 20.7,50.8 21.84,50.8 22.86,49.78 22.86,42.04 24.77,40.13 24.77,35.31
IO32  (via drill 0.35)
  Top 0.254: 52.7,32.26 51.44,33.53 v51.44,34.92 51.69,34.92 54.36,37.59 72.77,37.59 81.15,29.21 U6.1 | U4.7 33.09,34.87 34.04,35.81 37.85,35.81 v37.97,35.69
  Top 0.305: U1.8 52.72,32.24 52.7,32.26
  Bottom 0.254: v37.97,35.69 38.1,35.56 50.8,35.56 v51.44,34.92
IO33  (via drill 0.35)
  Top 0.254: 51.44,32.77 50.42,33.78 50.42,35.56 v53.85,38.99 53.85,40.26 51.31,42.8 41.66,42.8 v41.53,42.93 | v56.39,35.94 60.33,35.94 66.04,30.23 70.61,30.23 74.17,26.67 C14.1 | U4.8 30.55,35.89 31.62,36.96 37.72,36.96 38.48,37.72 v38.86,37.72
  Top 0.305: U1.9 51.45,32.05 51.46,32.06 51.46,32.74 51.44,32.77
  Bottom 0.254: v56.39,35.94 56.39,36.45 v53.85,38.99 | v41.53,42.93 41.53,40.39 v38.86,37.72
IO34  (via drill 0.35)
  Top 0.254: U1.6 55.26,30.71 55.88,31.33 55.88,32.26 55.24,32.89 v54.23,32.89 | v40.26,36.32 40.26,35.43 38.86,34.04 38.86,33.66 38.23,33.02 U4.5 | CAM1.14 47.12,62.23 v56.13,53.21
  Bottom 0.254: v40.26,36.32 41.02,37.08 51.69,37.08 54.23,34.54 v54.23,32.89 54.23,30.99 57.15,30.99 57.15,52.2 v56.13,53.21
IO35  (via drill 0.35)
  Top 0.254: v55.12,31.88 54.1,30.86 | v40.26,37.59 39.88,37.59 39.37,37.08 39.37,35.69 37.85,34.16 36.4,34.16 35.63,33.4 U4.6
  Top 0.305: 54.1,30.86 53.99,30.75 U1.7
  Bottom 0.254: v55.12,31.88 55.12,34.54 52.07,37.59 43.05,37.59 | 43.05,37.59 v40.26,37.59 | CAM1.13 36.83,63.25 37.08,63.5 41.02,63.5 43.05,61.47 43.05,37.59
N$1
  Top 0.305: R1.2 37,23.11 T1.B
N$2  (via drill 0.35)
  Top 0.254: T2.B 37.53,30.16 36.45,29.08 v36.45,26.8 | v36.2,21.46 34.54,19.81 31.88,19.81 31.75,19.68 31.75,15.88 33.91,13.72 35.69,13.72 35.94,13.97 R2.2
  Bottom 0.254: v36.45,26.8 36.32,26.67 36.32,21.59 v36.2,21.46
N$3
  Top 0.254: LED1.C 88.9,69.05 88.27,68.42 85.22,68.42 83.95,67.15 83.95,62.65 R10.2
N$4
  Top 0.254: U11.+ 77.47,23.37 77.09,23.75 77.09,26.67 C14.2 76.96,26.67 76.96,27.81 72.39,32.38 R21.1
N$5
  Top 0.305: U6.3 90.17,26.58 R9.1
N$6
  Top 0.305: U5.3 90.17,44.36 R11.1
N$7
  Top 0.254: 68.58,35.18 64.77,35.18 R23.1 | 68.58,35.18 72.39,35.18 R21.2 | 68.58,35.18 R22.2
N$8
  Top 0.254: U5.7 88.01,54.99 88.01,57.15 R19.1
N$9
  Top 0.254: U6.7 87.63,37.08 89.66,39.12 89.66,40.64 R18.1
N$10
  Bottom 0.254: SJ2.2 3.81,59.56 4.19,59.94 7.37,59.94 8.51,58.8 8.89,58.8 CN6.2
N$11
  Bottom 0.254: CN6.1 7.75,56.69 7.29,57.15 3.94,57.15 3.81,57.02 SJ1.2
N$13
  Top 0.254: R14.2 10.16,22.48 11.18,22.48 11.56,22.86 CN3USB.CC1 13.59,22.86 13.97,22.48 15.24,22.48 R13.2
N$14
  Top 0.254: R15.2 10.16,25.78 11.3,25.78 11.68,25.4 CN3USB.CC2 13.59,25.4 13.97,25.78 15.24,25.78 R16.2
N$74  (via drill 0.35)
  Top 0.254: CN4USB.2 6.84,20.97 7.75,20.07 v7.75,17.78
  Top 0.305: U3.12 23.19,13.54 v23.5,13.84
  Bottom 0.254: v7.75,17.78 7.75,16.89 9.4,15.24 CN3USB.D-
  Bottom 0.305: CN3USB.D- 13.88,15.24 14.03,15.39 20.18,15.39 21.62,13.95 23.39,13.95 v23.5,13.84
N$81  (via drill 0.35)
  Top 0.254: CN4USB.3 6.1,20.32 6.99,19.43 v6.99,19.3 | U3.11 22.54,14.73 v22.86,14.73
  Bottom 0.254: v6.99,19.3 9.91,19.3 11.43,17.78 CN3USB.D+ 12.83,17.78 13.84,16.76 19.56,16.76 21.59,14.73 v22.86,14.73
N$82
  Top 0.254: R3.2 PWR.C
N$84
  Top 0.254: R5.2 RXD.C
P0
  Top 0.254: CN7.1 20.11,45.26 23.37,48.51 23.37,52.83 27.69,57.15 U7.4
P1
  Top 0.254: CN7.2 10.54,47.26 11.43,48.15 21.97,48.15 22.86,49.04 22.86,58.17 24.38,59.69 U7.5
P3
  Bottom 0.254: SJ5.1 77.56,68.58 74.97,71.17 67.99,71.17 64.39,67.56 42.5,67.56 41.1,68.96 36.11,68.96 31.92,64.77 U7.7
P4  (via drill 0.35)
  Top 0.254: 71.75,58.42 U8.1 | U8.13 69.72,59.69 | U8.10 69.72,63.5 69.72,59.69 | 71.75,58.42 71.75,62.23 U8.4 75.69,62.23 77.09,60.83 79.38,60.83 80.14,60.07 80.14,50.16 76.96,46.99 U9.1 | U9.4 72.77,50.8 71.25,50.8 | 61.09,48.77 64.68,48.77 R20.2 64.77,48.26 U9.13 69.32,48.26 69.9,48.84 | 61.09,48.77 54.99,48.77 53.59,50.16 53.59,54.74 47.37,60.96 33.27,60.96 30.73,63.5 21.08,63.5 20.32,64.26 20.32,66.93 20.7,67.31 U7.9 | 71.75,58.42 71.05,58.42 70.29,59.18 70.23,59.18 69.72,59.69 | U9.10 66.29,52.07 v65.41,52.96 | v61.09,50.42 61.09,48.77
  Top 0.305: 71.25,50.8 71.25,48.9 69.95,48.9 69.9,48.84 | U9.1 73.03,46.99 72.77,47.24 72.77,50.8
  Bottom 0.254: v65.41,52.96 61.72,52.96 61.09,52.32 v61.09,50.42
P5
  Top 0.254: SW.1 93.98,61.34 88.9,61.34 R8.2 | U7.10 22.57,64.77 23.84,66.04 30.35,66.04 32.89,63.5 46.74,63.5 56.26,53.98 62.61,53.98 64.01,55.37 64.01,65.15 66.67,67.82 77.6,67.82 84.07,61.34
  Top 0.305: 84.07,61.34 88.9,61.34
P6  (via drill 0.35)
  Top 0.254: v11.81,54.99 11.81,55.5 14.73,58.42 16.86,58.42 20.67,62.23 U7.11
  Bottom 0.254: SJ1.1 2.29,54.74 3.05,53.98 10.79,53.98 v11.81,54.99
P7
  Bottom 0.254: SJ2.1 2.29,59.56 11.3,68.58 16.38,68.58 17.49,67.47 17.49,62.48 20.29,59.69 U7.12
PCLK  (via drill 0.35)
  Top 0.254: U8.9 65.91,64.77 65.28,64.14 v65.28,59.94 | v50.55,53.47 50.42,53.34 38.48,53.34 38.1,53.72 38.1,54.36 37.85,54.61 CAM1.7
  Bottom 0.254: v50.55,53.47 54.23,57.15 62.48,57.15 v65.28,59.94
RTS
  Top 0.254: R2.1 37.68,15.91 37.08,16.51
  Top 0.305: U3.2 27.62,15.56 27.79,15.39 31.48,15.39 34.06,12.81 37.68,12.81 R2.1 | 37.08,16.51 37,16.59 T1.E
RXD0
  Top 0.254: 56.52,12.57 54.74,14.35 46.61,14.35 45.09,12.83 43.81,12.83 43.56,12.57 41.73,12.57 41.73,11.51 41.53,11.3 40.51,11.3 39.75,10.54 39.75,9.65 40.13,9.27 41.4,9.27 41.91,8.76 | U3.20 28.26,12.19 31.88,12.19 35.17,8.89 36.09,8.89 37.36,7.62 U4.24 38.94,7.62 40.21,6.35 41.98,6.35
  Top 0.305: 56.52,12.57 56.53,12.56 U1.34 | 41.91,8.76 41.98,8.7 41.98,6.35
SCL  (via drill 0.35)
  Top 0.254: v6.73,55.37 10.54,55.37 11.43,56.26 11.43,58.04 11.81,58.42 v13.08,58.42 | R17.1 46.39,3.81 46.01,4.19 46.01,4.83 45.51,5.33 v44.83,5.33 | 59.05,10.16 56.39,7.49 54.99,7.49 52.45,4.95 51.94,4.95 v50.93,5.97 | CN5.1 79.2,7.75 78.56,7.11 69.85,7.11 67.56,4.83 v67.56,3.56 | v38.61,36.58 38.48,36.45 32.89,36.45 31.88,35.43 31.88,32.51 32.89,31.5 32.89,29.34 32.64,29.08 31.24,29.08 30.86,28.7 v30.86,26.42 | v45.85,17.65 48.39,17.65 50.93,15.11 56.64,15.11 59.07,12.69 U1.36
  Top 0.305: 59.05,10.16 59.07,10.18 U1.36
  Bottom 0.254: SJ1.3 6.22,55.88 v6.73,55.37 | v13.08,58.42 18.16,58.42 21.43,55.15 U7.14 24.89,54.61 28.7,50.8 34.67,50.8 35.94,49.53 CAM1.3 37.59,49.53 38.86,48.26 39.88,48.26 40.77,47.37 40.77,40.89 38.1,38.23 38.1,37.08 v38.61,36.58 | U4.22 43.26,6.4 44.32,5.33 v44.83,5.33 44.96,5.21 50.16,5.21 v50.93,5.97 51.69,6.73 53.09,6.73 56.26,3.56 v67.56,3.56 | v30.86,26.42 31.5,25.78 31.5,24 35.31,20.19 43.31,20.19 v45.85,17.65
SD0  (via drill 0.35)
  Top 0.254: 48.9,18.41 51.18,16.13 59.05,16.13 62.61,12.57 62.61,9.91 61.34,8.64 59.31,8.64 57.15,6.48 55.88,6.48 52.32,2.92 51.31,2.92 v50.42,2.03 | v13.46,1.65 7.24,1.65 6.22,2.67 6.22,5.33 5.16,6.4 U4.37
  Top 0.305: 48.9,18.41 48.87,18.44 43.4,18.44 U1.21
  Bottom 0.254: 49.78,1.27 13.84,1.27 v13.46,1.65
  Bottom 0.305: 49.78,1.27 50.42,1.91 v50.42,2.03
SD1  (via drill 0.35)
  Top 0.254: U1.22 41.92,17.13 v41.78,17.27 | 7.75,9.4 7.75,7.62 U4.36
  Top 0.305: v30.99,18.8 30.99,17.27 v30.86,17.14 | v27.81,19.56 27.53,19.56 27.27,19.3 21.24,19.3 19.48,17.55 18.32,17.55 14.99,14.22 14.99,12.7 12.95,10.67 9.02,10.67 7.75,9.4
  Bottom 0.305: v41.78,17.27 41.66,17.14 36.96,17.14 36.7,17.4 35.78,17.4 35.63,17.25 34.43,17.25 33.11,18.57 31.22,18.57 v30.99,18.8 | v30.86,17.14 30.23,17.14 v27.81,19.56
SD2  (via drill 0.35)
  Top 0.254: v41.02,23.62 41.16,23.48 | v13.97,31.75 10.62,31.75 10.23,32.13 U4.16
  Top 0.305: 41.16,23.48 U1.17
  Bottom 0.254: v41.02,23.62 41.53,24.13 41.53,25.71 38.54,28.7 16.55,28.7 13.97,31.29 v13.97,31.75
SD3
  Top 0.254: 42.8,29.21 42.8,30.61 41.66,31.75 40.26,31.75 39.5,32.51 39.5,33.66 41.02,35.18 41.02,38.1 40.64,38.48 29.46,38.48 26.04,35.05 16.38,35.05 15.62,34.29 8.96,34.29 U4.17
  Top 0.305: U1.18 41.84,22.21 41.6,22.45 40.71,22.45 39.98,23.17 39.98,25.09 42.8,27.91 42.8,29.21
SD_CS  (via drill 0.35)
  Top 0.254: v69.72,52.83 69.72,50.8 U9.11
  Bottom 0.254: U10.SD_CS 77.09,62.23 69.09,54.23 69.09,53.47 v69.72,52.83
SD_MISO
  Top 0.254: U10.SD_MISO 77.85,57.15 77.47,56.77 77.47,49.15 76.58,48.26 U9.2
SD_MOSI
  Top 0.254: U10.SD_MOSI 77.34,59.69 76.71,59.05 76.71,54.23 75.82,53.34 U9.6
SD_SCK  (via drill 0.35)
  Top 0.254: v69.85,53.85 69.85,54.23 69.47,54.61 U9.8
  Bottom 0.254: U10.SD_SCK 78.74,55.37 78.36,55.75 77.22,55.75 76.2,56.77 72.77,56.77 v69.85,53.85
SDA  (via drill 0.35)
  Top 0.254: v6.73,59.05 6.1,59.05 5.21,58.17 5.21,53.34 | 5.21,53.34 18.92,53.34 20.19,52.07 U7.15 | CAM1.4 38.35,49.53 38.1,49.78 38.1,50.29 37.59,50.8 35.81,50.8 33.27,53.34 27.94,53.34 v26.16,51.56 | U1.33 55.26,9.93 54.88,9.55 53.11,9.55 52.07,8.51 v52.07,5.97 | CN5.2 77.2,11.18 72.12,11.18 65.39,4.45 56.64,4.45 53.21,1.02 42.55,1.02 v42.55,2.03 42.55,3.39 R12.1 | 5.21,53.34 5.21,50.93 4.06,49.78 v4.06,40.64 | U4.25 35.56,7.62 32.38,10.79 v32,10.79
  Bottom 0.254: SJ2.3 6.35,58.42 6.73,58.8 v6.73,59.05 | v26.16,51.56 25.65,52.07 U7.15 | U4.25 35.69,7.62 35.69,3.68 37.47,1.91 42.42,1.91 v42.55,2.03 42.8,1.78 48.51,1.78 52.07,5.33 v52.07,5.97 | v4.06,40.64 5.33,40.64 6.48,39.5 6.48,32.38 11.18,27.69 11.18,24.77 11.81,24.13 16.76,24.13 28.7,12.19 28.7,11.05 29.21,10.54 31.75,10.54 v32,10.79
SENSOR_VN  (via drill 0.35)
  Top 0.254: 56.53,32.5 55.12,33.91 v53.47,33.91 | v41.78,36.32 41.78,34.54 40.72,33.48 U4.4 | v43.43,36.32 43.43,37.59 v42.29,38.73
  Top 0.305: U1.5 56.53,32.5
  Bottom 0.254: v53.47,33.91 53.47,34.42 51.56,36.32 v43.43,36.32 v41.78,36.32 | v42.29,38.73 42.29,60.33 41.66,60.96 36.2,60.96 35.43,61.72 35.43,64.39 35.81,64.77 CAM1.15
SENSOR_VP  (via drill 0.35)
  Top 0.254: 57.78,33.02 v54.86,35.94 | v43.81,38.48 44.2,38.1 44.2,35.56 43.81,35.18 43.81,33.53 43.31,33.02 U4.3
  Top 0.305: U1.4 57.8,33.01 57.78,33.02
  Bottom 0.254: v54.86,35.94 52.7,38.1 44.2,38.1 v43.81,38.48 43.81,39.37 43.56,39.62 43.56,61.72 40.51,64.77 CAM1.16
SP_L  (via drill 0.35)
  Top 0.254: CN2.4@1 93.04,11.81 95.5,11.81 97.43,13.75 97.43,66.48 93.47,70.44 v93.47,70.48
  Bottom 0.254: v93.47,70.48 93.47,71.75 90.3,74.93 SJ4.2
TTXD
  Top 0.254: R4.2 TXD.C
TXD0  (via drill 0.35)
  Top 0.254: 57.78,9.78 56.39,8.38 v53.47,8.38
  Top 0.305: U3.4 26.35,14.92 26.54,14.73 31.35,14.73 34.93,11.15 36.98,11.15 39.5,8.64 40.64,8.64 40.72,8.56 U4.23 | 57.78,9.78 57.8,9.79 U1.35
  Bottom 0.254: v53.47,8.38 51.05,8.38 49.02,6.35 47.5,6.35 46.99,6.86 46.99,8.51 45.97,9.53 41.78,9.53 40.72,8.46 U4.23
VSYNC  (via drill 0.35)
  Top 0.254: U8.5 75.56,63.5 75.95,63.88 75.95,66.55 75.44,67.06 v67.31,67.06
  Bottom 0.254: v67.31,67.06 42.29,67.06 40.89,68.45 36.32,68.45 33.53,65.66 33.53,54.1 35.56,52.07 CAM1.5
XCLK  (via drill 0.35)
  Top 0.254: v66.04,62.23 U8.11 | v48.01,54.61 CAM1.8
  Bottom 0.254: v66.04,62.23 65.53,62.23 63.25,59.94 53.34,59.94 v48.01,54.61

### Text on the board
tPlace: 5V | GND | 5V
bPlace: I2C | P6/P7
tNames: I2C/DIO(P6/P7) | DIO(P0/P1) | ALGYAN 7th | I2C | Designed by Y.Ohe
bNames: IO26-SP_L | IO26-LED1 | P3-LED1